# EAGLE design 20240717-7439 (EAGLE 6.6.0)

## Sheet 1 of 3
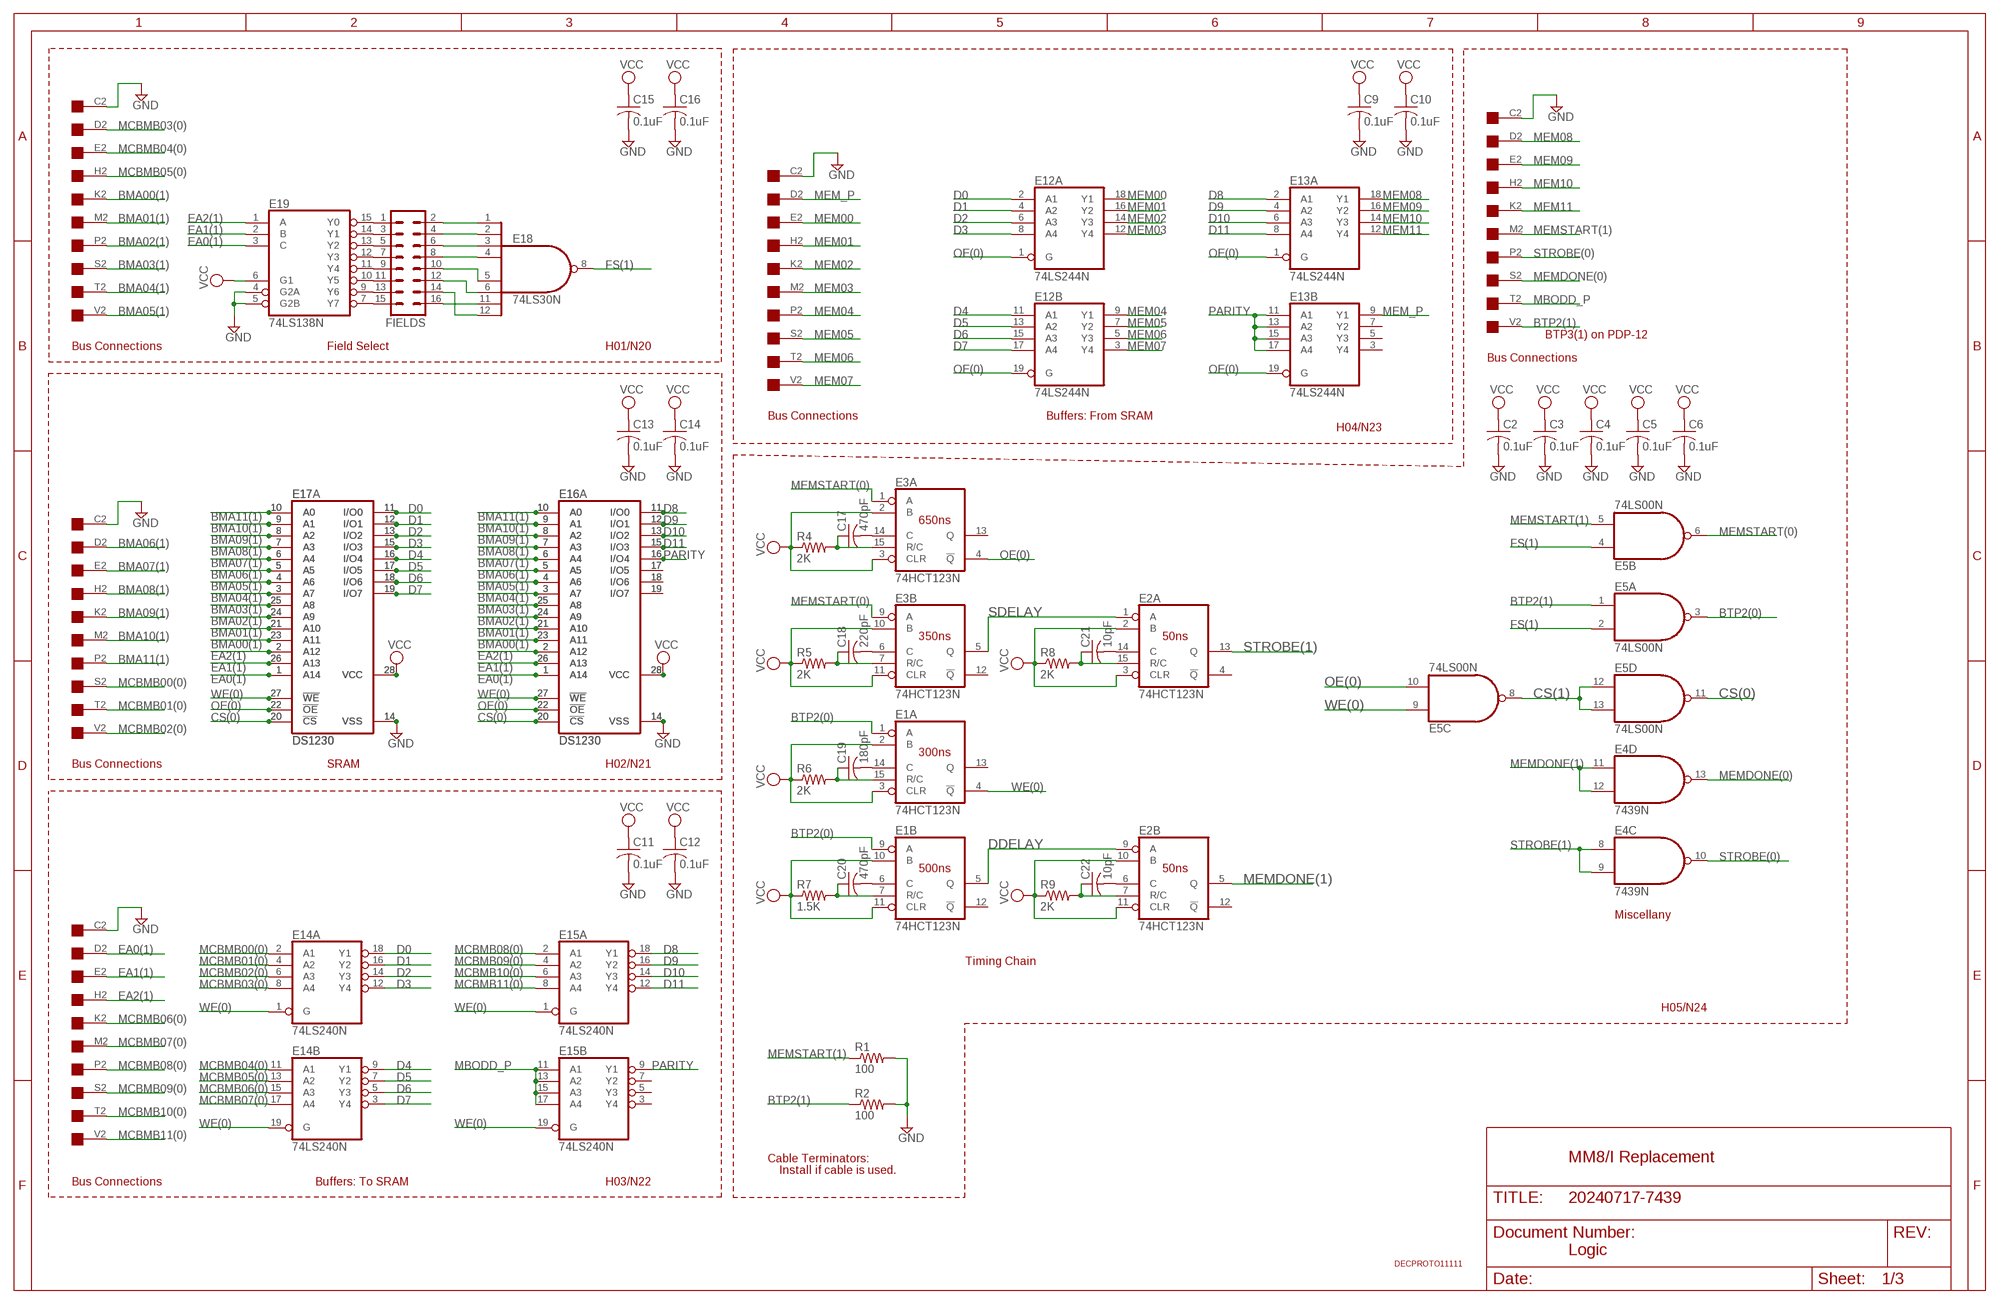
[diagram p0: schematic, sheet 1]

### Parts
C2  0.1uF  C-US050-025X075  [C050-025X075]
C3  0.1uF  C-US050-025X075  [C050-025X075]
C4  0.1uF  C-US050-025X075  [C050-025X075]
C5  0.1uF  C-US050-025X075  [C050-025X075]
C6  0.1uF  C-US050-025X075  [C050-025X075]
C9  0.1uF  C-US050-025X075  [C050-025X075]
C10  0.1uF  C-US050-025X075  [C050-025X075]
C11  0.1uF  C-US050-025X075  [C050-025X075]
C12  0.1uF  C-US050-025X075  [C050-025X075]
C13  0.1uF  C-US050-025X075  [C050-025X075]
C14  0.1uF  C-US050-025X075  [C050-025X075]
C15  0.1uF  C-US050-025X075  [C050-025X075]
C16  0.1uF  C-US050-025X075  [C050-025X075]
C17  470pF  C-US050-025X075  [C050-025X075]
C18  220pF  C-US050-025X075  [C050-025X075]
C19  180pF  C-US050-025X075  [C050-025X075]
C20  470pF  C-US050-025X075  [C050-025X075]
C21  10pF  C-US050-025X075  [C050-025X075]
C22  10pF  C-US050-025X075  [C050-025X075]
E1  74HCT123N  74LS123N  [DIL16]
E2  74HCT123N  74LS123N  [DIL16]
E3  74HCT123N  74LS123N  [DIL16]
E4  7439N  74LS01N  [DIL14]
E5  74LS00N  [DIL14]
E12  74LS244N  74S244N  [DIL20]
E13  74LS244N  74S244N  [DIL20]
E14  74LS240N  74S240N  [DIL20]
E15  74LS240N  74S240N  [DIL20]
E16  DS1230  62256P  [DIL28-6]
E16A  DS1230  62832P  [DIL28-3]
E17  DS1230  62256P  [DIL28-6]
E17A  DS1230  62832P  [DIL28-3]
E18  74LS30N  [DIL14]
E19  74LS138N  [DIL16]
FIELDS  MA08-2  [MA08-2]
H01  EDGE-1  [EDGE-CON1]
H02  EDGE-1  [EDGE-CON1]
H03  EDGE-1  [EDGE-CON1]
H04  EDGE-1  [EDGE-CON1]
H05  EDGE-1  [EDGE-CON1]
R1  100  R-US_0207/10  [0207/10]
R2  100  R-US_0207/10  [0207/10]
R4  2K  R-US_0207/10  [0207/10]
R5  2K  R-US_0207/10  [0207/10]
R6  2K  R-US_0207/10  [0207/10]
R7  1.5K  R-US_0207/10  [0207/10]
R8  2K  R-US_0207/10  [0207/10]
R9  2K  R-US_0207/10  [0207/10]
U$6  DECPROTO11111  [DECPROTO11111]

### Nets
BMA00(1): E16.23(A11) E16A.23(A11) E17.23(A11) E17A.23(A11) H01.K2 ; also sheet 2
BMA01(1): E16.21(A10) E16A.21(A10) E17.21(A10) E17A.21(A10) H01.M2 ; also sheet 2
BMA02(1): E16.24(A9) E16A.24(A9) E17.24(A9) E17A.24(A9) H01.P2 ; also sheet 2
BMA03(1): E16.25(A8) E16A.25(A8) E17.25(A8) E17A.25(A8) H01.S2 ; also sheet 2
BMA04(1): E16.3(A7) E16A.3(A7) E17.3(A7) E17A.3(A7) H01.T2 ; also sheet 2
BMA05(1): E16.4(A6) E16A.4(A6) E17.4(A6) E17A.4(A6) H01.V2 ; also sheet 2
BMA06(1): E16.5(A5) E16A.5(A5) E17.5(A5) E17A.5(A5) H02.D2 ; also sheet 2
BMA07(1): E16.6(A4) E16A.6(A4) E17.6(A4) E17A.6(A4) H02.E2 ; also sheet 2
BMA08(1): E16.7(A3) E16A.7(A3) E17.7(A3) E17A.7(A3) H02.H2 ; also sheet 2
BMA09(1): E16.8(A2) E16A.8(A2) E17.8(A2) E17A.8(A2) H02.K2 ; also sheet 2
BMA10(1): E16.9(A1) E16A.9(A1) E17.9(A1) E17A.9(A1) H02.M2 ; also sheet 2
BMA11(1): E16.10(A0) E16A.10(A0) E17.10(A0) E17A.10(A0) H02.P2 ; also sheet 2
BTP2(0): E1.1(A:A) E1.9(B:A) E5.3(A:O)
BTP2(1): E5.1(A:I0) H05.V2 R2.1
CS(0): E5.11(D:O) E16.20(!CS) E16A.20(!CS) E17.20(!CS) E17A.20(!CS) ; also sheet 2
CS(1): E5.8(C:O) E5.12(D:I0) E5.13(D:I1)
D0: E12.2(A:A1) E14.18(A:Y1) E17.11(I/O0) E17A.11(I/O0) ; also sheet 2
D1: E12.4(A:A2) E14.16(A:Y2) E17.12(I/O1) E17A.12(I/O1) ; also sheet 2
D2: E12.6(A:A3) E14.14(A:Y3) E17.13(I/O2) E17A.13(I/O2) ; also sheet 2
D3: E12.8(A:A4) E14.12(A:Y4) E17.15(I/O3) E17A.15(I/O3) ; also sheet 2
D4: E12.11(B:A1) E14.9(B:Y1) E17.16(I/O4) E17A.16(I/O4) ; also sheet 2
D5: E12.13(B:A2) E14.7(B:Y2) E17.17(I/O5) E17A.17(I/O5) ; also sheet 2
D6: E12.15(B:A3) E14.5(B:Y3) E17.18(I/O6) E17A.18(I/O6) ; also sheet 2
D7: E12.17(B:A4) E14.3(B:Y4) E17.19(I/O7) E17A.19(I/O7) ; also sheet 2
D8: E13.2(A:A1) E15.18(A:Y1) E16.11(I/O0) E16A.11(I/O0) ; also sheet 2
D9: E13.4(A:A2) E15.16(A:Y2) E16.12(I/O1) E16A.12(I/O1) ; also sheet 2
D10: E13.6(A:A3) E15.14(A:Y3) E16.13(I/O2) E16A.13(I/O2) ; also sheet 2
D11: E13.8(A:A4) E15.12(A:Y4) E16.15(I/O3) E16A.15(I/O3) ; also sheet 2
DDELAY: E1.5(B:Q) E2.9(B:A)
EA0(1): E16.1(A14) E16A.1(A14) E17.1(A14) E17A.1(A14) E19.3(C) H03.D2 ; also sheet 2
EA1(1): E16.26(A13) E16A.26(A13) E17.26(A13) E17A.26(A13) E19.2(B) H03.E2 ; also sheet 2
EA2(1): E16.2(A12) E16A.2(A12) E17.2(A12) E17A.2(A12) E19.1(A) H03.H2 ; also sheet 2
FS(1): E5.2(A:I1) E5.4(B:I0) E18.8(O) ; also sheet 2
GND [supply]: C2.2 C3.2 C4.2 C5.2 C6.2 C9.2 C10.2 C11.2 C12.2 C13.2 C14.2 C15.2 C16.2 E16.14(VSS) E16A.14(VSS) E17.14(VSS) E17A.14(VSS) E19.4(G2A) E19.5(G2B) H01.C2 H02.C2 H03.C2 H04.C2 H05.C2 R1.2 R2.2 ; also sheet 2
MBODD_P: E15.11(B:A1) E15.13(B:A2) E15.15(B:A3) E15.17(B:A4) H05.T2 ; also sheet 2
MCBMB00(0): E14.2(A:A1) H02.S2 ; also sheet 2
MCBMB01(0): E14.4(A:A2) H02.T2 ; also sheet 2
MCBMB02(0): E14.6(A:A3) H02.V2 ; also sheet 2
MCBMB03(0): E14.8(A:A4) H01.D2 ; also sheet 2
MCBMB04(0): E14.11(B:A1) H01.E2 ; also sheet 2
MCBMB05(0): E14.13(B:A2) H01.H2 ; also sheet 2
MCBMB06(0): E14.15(B:A3) H03.K2
MCBMB07(0): E14.17(B:A4) H03.M2
MCBMB08(0): E15.2(A:A1) H03.P2
MCBMB09(0): E15.4(A:A2) H03.S2
MCBMB10(0): E15.6(A:A3) H03.T2
MCBMB11(0): E15.8(A:A4) H03.V2
MEM00: E12.18(A:Y1) H04.E2
MEM01: E12.16(A:Y2) H04.H2
MEM02: E12.14(A:Y3) H04.K2
MEM03: E12.12(A:Y4) H04.M2
MEM04: E12.9(B:Y1) H04.P2
MEM05: E12.7(B:Y2) H04.S2
MEM06: E12.5(B:Y3) H04.T2
MEM07: E12.3(B:Y4) H04.V2
MEM08: E13.18(A:Y1) H05.D2 ; also sheet 2
MEM09: E13.16(A:Y2) H05.E2 ; also sheet 2
MEM10: E13.14(A:Y3) H05.H2 ; also sheet 2
MEM11: E13.12(A:Y4) H05.K2 ; also sheet 2
MEM_P: E13.9(B:Y1) H04.D2
MEMDONE(0): E4.13(D:O) H05.S2
MEMDONE(1): E2.5(B:Q) E4.11(D:I0) E4.12(D:I1)
MEMSTART(0): E3.1(A:A) E3.9(B:A) E5.6(B:O)
MEMSTART(1): E5.5(B:I1) H05.M2 R1.1
N$2: E16.17(I/O5) E16A.17(I/O5)
N$3: E16.18(I/O6) E16A.18(I/O6)
N$4: E16.19(I/O7) E16A.19(I/O7)
N$5: C17.1 E3.15(A:R/C) R4.2
N$6: C17.2 E3.14(A:C)
N$7: C18.1 E3.7(B:R/C) R5.2
N$8: C18.2 E3.6(B:C)
N$9: C19.1 E1.15(A:R/C) R6.2
N$10: C19.2 E1.14(A:C)
N$11: C20.1 E1.7(B:R/C) R7.2
N$12: C20.2 E1.6(B:C)
N$13: C21.1 E2.15(A:R/C) R8.2
N$14: C21.2 E2.14(A:C)
N$15: C22.1 E2.7(B:R/C) R9.2
N$16: C22.2 E2.6(B:C)
N$18: E19.15(Y0) FIELDS.1
N$19: E19.14(Y1) FIELDS.3
N$20: E19.13(Y2) FIELDS.5
N$21: E19.12(Y3) FIELDS.7
N$22: E19.11(Y4) FIELDS.9
N$23: E19.10(Y5) FIELDS.11
N$24: E19.9(Y6) FIELDS.13
N$25: E19.7(Y7) FIELDS.15
N$26: E18.4(I3) FIELDS.8
N$27: E18.3(I2) FIELDS.6
N$28: E18.2(I1) FIELDS.4
N$29: E18.1(I0) FIELDS.2
N$30: E18.5(I4) FIELDS.10
N$31: E18.6(I5) FIELDS.12
N$32: E18.12(I7) FIELDS.14
N$33: E18.11(I6) FIELDS.16
OE(0): E3.4(A:!Q) E5.10(C:I1) E12.1(A:G) E12.19(B:G) E13.1(A:G) E13.19(B:G) E16.22(!OE) E16A.22(!OE) E17.22(!OE) E17A.22(!OE) ; also sheet 2
PARITY: E13.11(B:A1) E13.13(B:A2) E13.15(B:A3) E13.17(B:A4) E15.9(B:Y1) E16.16(I/O4) E16A.16(I/O4) ; also sheet 2
SDELAY: E2.1(A:A) E3.5(B:Q)
STROBE(0): E4.10(C:O) H05.P2
STROBE(1): E2.13(A:Q) E4.8(C:I0) E4.9(C:I1)
VCC [supply]: C2.1 C3.1 C4.1 C5.1 C6.1 C9.1 C10.1 C11.1 C12.1 C13.1 C14.1 C15.1 C16.1 E1.2(A:B) E1.3(A:CLR) E1.10(B:B) E1.11(B:CLR) E2.2(A:B) E2.3(A:CLR) E2.10(B:B) E2.11(B:CLR) E3.2(A:B) E3.3(A:CLR) E3.10(B:B) E3.11(B:CLR) E16.28(VCC) E16A.28(VCC) E17.28(VCC) E17A.28(VCC) E19.6(G1) R4.1 R5.1 R6.1 R7.1 R8.1 R9.1 ; also sheet 2
WE(0): E1.4(A:!Q) E5.9(C:I0) E14.1(A:G) E14.19(B:G) E15.1(A:G) E15.19(B:G) E16.27(!WE) E16A.27(!WE) E17.27(!WE) E17A.27(!WE) ; also sheet 2
Unconnected: E1.12(B:!Q) E1.13(A:Q) E2.4(A:!Q) E2.12(B:!Q) E3.12(B:!Q) E3.13(A:Q) E13.3(B:Y4) E13.5(B:Y3) E13.7(B:Y2) E15.3(B:Y4) E15.5(B:Y3) E15.7(B:Y2) H01.A2 H01.B2 H01.F2 H01.J2 H01.L2 H01.N2 H01.R2 H01.U2 H02.A2 H02.B2 H02.F2 H02.J2 H02.L2 H02.N2 H02.R2 H02.U2 H03.A2 H03.B2 H03.F2 H03.J2 H03.L2 H03.N2 H03.R2 H03.U2 H04.A2 H04.B2 H04.F2 H04.J2 H04.L2 H04.N2 H04.R2 H04.U2 H05.A2 H05.B2 H05.F2 H05.J2 H05.L2 H05.N2 H05.R2 H05.U2

### Notes on the sheet
- BTP3(1) on PDP-12
- Bus Connections | Field Select | H01/N20
- Bus Connections
- Bus Connections | Buffers: From SRAM
- H04/N23
- 650ns
- 350ns | 50ns
- 300ns
- Bus Connections | SRAM | H02/N21
- 500ns | 50ns
- Miscellany
- Timing Chain
- H05/N24
- Cable Terminators: | MM8/I Replacement
- Install if cable is used.
- Bus Connections | Buffers: To SRAM | H03/N22
- Logic

## Sheet 2 of 3
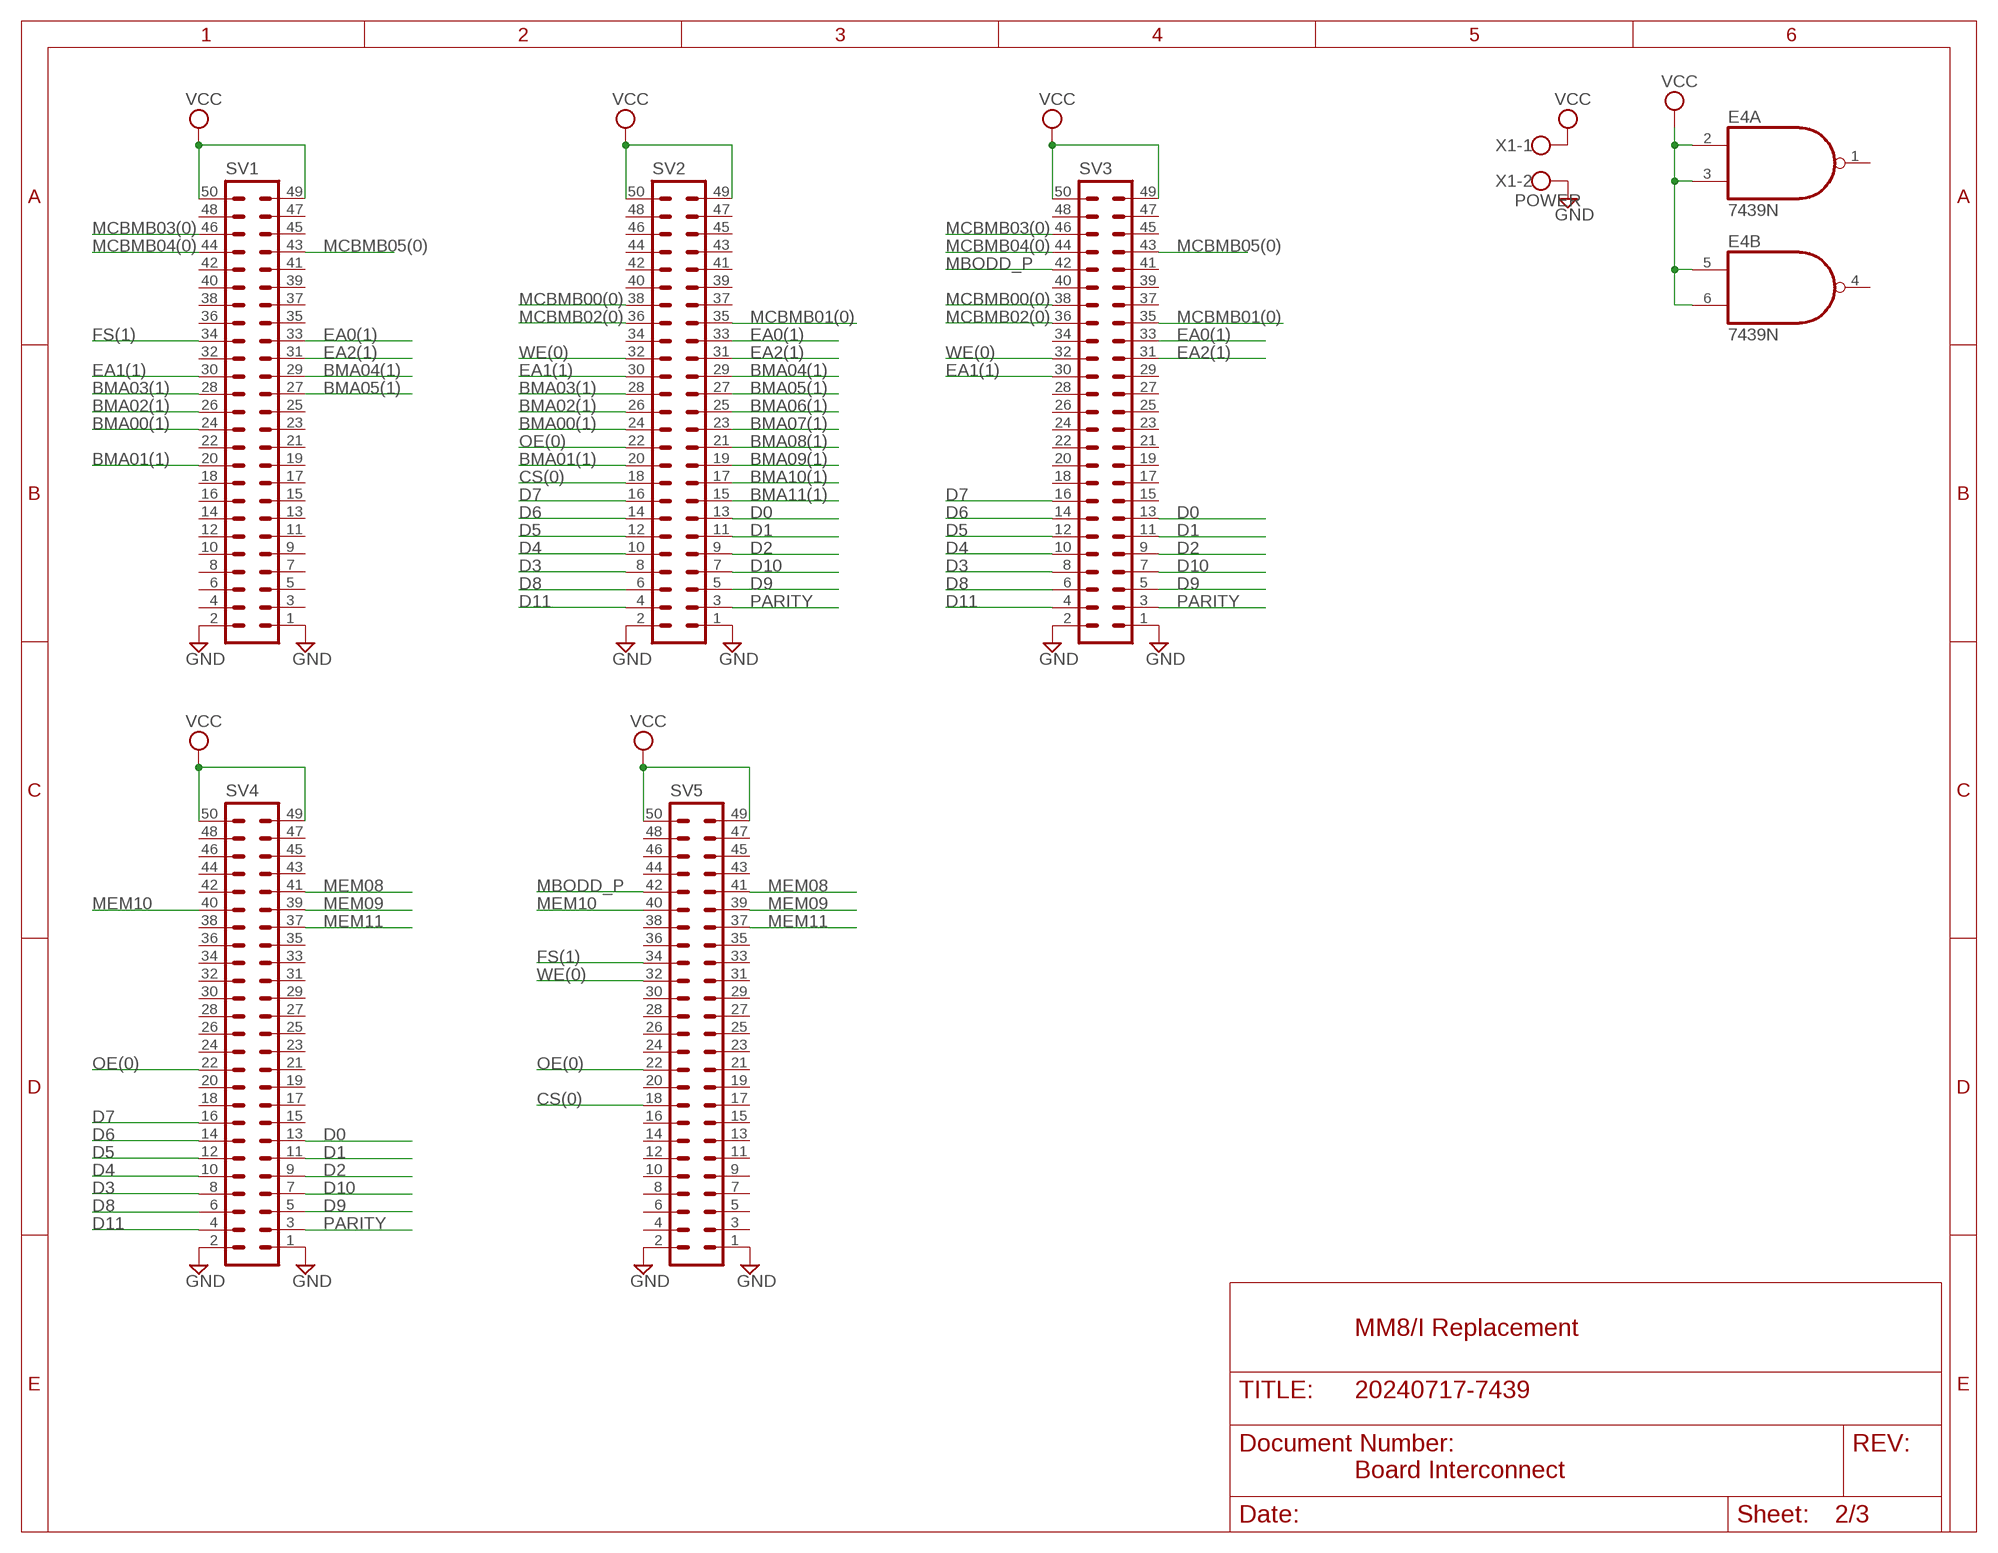
[diagram p1: schematic, sheet 2]

### Parts
SV1  ML50L  [ML50L]
SV2  ML50L  [ML50L]
SV3  ML50L  [ML50L]
SV4  ML50L  [ML50L]
SV5  ML50L  [ML50L]
X1  POWER  W237-102  [W237-102]

### Nets
BMA00(1): SV1.24 SV2.24 ; also sheet 1
BMA01(1): SV1.20 SV2.20 ; also sheet 1
BMA02(1): SV1.26 SV2.26 ; also sheet 1
BMA03(1): SV1.28 SV2.28 ; also sheet 1
BMA04(1): SV1.29 SV2.29 ; also sheet 1
BMA05(1): SV1.27 SV2.27 ; also sheet 1
BMA06(1): SV2.25 ; also sheet 1
BMA07(1): SV2.23 ; also sheet 1
BMA08(1): SV2.21 ; also sheet 1
BMA09(1): SV2.19 ; also sheet 1
BMA10(1): SV2.17 ; also sheet 1
BMA11(1): SV2.15 ; also sheet 1
CS(0): SV2.18 SV5.18 ; also sheet 1
D0: SV2.13 SV3.13 SV4.13 ; also sheet 1
D1: SV2.11 SV3.11 SV4.11 ; also sheet 1
D2: SV2.9 SV3.9 SV4.9 ; also sheet 1
D3: SV2.8 SV3.8 SV4.8 ; also sheet 1
D4: SV2.10 SV3.10 SV4.10 ; also sheet 1
D5: SV2.12 SV3.12 SV4.12 ; also sheet 1
D6: SV2.14 SV3.14 SV4.14 ; also sheet 1
D7: SV2.16 SV3.16 SV4.16 ; also sheet 1
D8: SV2.6 SV3.6 SV4.6 ; also sheet 1
D9: SV2.5 SV3.5 SV4.5 ; also sheet 1
D10: SV2.7 SV3.7 SV4.7 ; also sheet 1
D11: SV2.4 SV3.4 SV4.4 ; also sheet 1
EA0(1): SV1.33 SV2.33 SV3.33 ; also sheet 1
EA1(1): SV1.30 SV2.30 SV3.30 ; also sheet 1
EA2(1): SV1.31 SV2.31 SV3.31 ; also sheet 1
FS(1): SV1.34 SV5.34 ; also sheet 1
GND [supply]: SV1.1 SV1.2 SV2.1 SV2.2 SV3.1 SV3.2 SV4.1 SV4.2 SV5.1 SV5.2 X1.2 ; also sheet 1
MBODD_P: SV3.42 SV5.42 ; also sheet 1
MCBMB00(0): SV2.38 SV3.38 ; also sheet 1
MCBMB01(0): SV2.35 SV3.35 ; also sheet 1
MCBMB02(0): SV2.36 SV3.36 ; also sheet 1
MCBMB03(0): SV1.46 SV3.46 ; also sheet 1
MCBMB04(0): SV1.44 SV3.44 ; also sheet 1
MCBMB05(0): SV1.43 SV3.43 ; also sheet 1
MEM08: SV4.41 SV5.41 ; also sheet 1
MEM09: SV4.39 SV5.39 ; also sheet 1
MEM10: SV4.40 SV5.40 ; also sheet 1
MEM11: SV4.37 SV5.37 ; also sheet 1
OE(0): SV2.22 SV4.22 SV5.22 ; also sheet 1
PARITY: SV2.3 SV3.3 SV4.3 ; also sheet 1
VCC [supply]: E4.2(A:I0) E4.3(A:I1) E4.5(B:I0) E4.6(B:I1) SV1.49 SV1.50 SV2.49 SV2.50 SV3.49 SV3.50 SV4.49 SV4.50 SV5.49 SV5.50 X1.1 ; also sheet 1
WE(0): SV2.32 SV3.32 SV5.32 ; also sheet 1
Unconnected: E4.1(A:O) E4.4(B:O) SV1.3 SV1.4 SV1.5 SV1.6 SV1.7 SV1.8 SV1.9 SV1.10 SV1.11 SV1.12 SV1.13 SV1.14 SV1.15 SV1.16 SV1.17 SV1.18 SV1.19 SV1.21 SV1.22 SV1.23 SV1.25 SV1.32 SV1.35 SV1.36 SV1.37 SV1.38 SV1.39 SV1.40 SV1.41 SV1.42 SV1.45 SV1.47 SV1.48 SV2.34 SV2.37 SV2.39 SV2.40 SV2.41 SV2.42 SV2.43 SV2.44 SV2.45 SV2.46 SV2.47 SV2.48 SV3.15 SV3.17 SV3.18 SV3.19 SV3.20 SV3.21 SV3.22 SV3.23 SV3.24 SV3.25 SV3.26 SV3.27 SV3.28 SV3.29 SV3.34 SV3.37 SV3.39 SV3.40 SV3.41 SV3.45 SV3.47 SV3.48 SV4.15 SV4.17 SV4.18 SV4.19 SV4.20 SV4.21 SV4.23 SV4.24 SV4.25 SV4.26 SV4.27 SV4.28 SV4.29 SV4.30 SV4.31 SV4.32 SV4.33 SV4.34 SV4.35 SV4.36 SV4.38 SV4.42 SV4.43 SV4.44 SV4.45 SV4.46 SV4.47 SV4.48 SV5.3 SV5.4 SV5.5 SV5.6 SV5.7 SV5.8 SV5.9 SV5.10 SV5.11 SV5.12 SV5.13 SV5.14 SV5.15 SV5.16 SV5.17 SV5.19 SV5.20 SV5.21 SV5.23 SV5.24 SV5.25 SV5.26 SV5.27 SV5.28 SV5.29 SV5.30 SV5.31 SV5.33 SV5.35 SV5.36 SV5.38 SV5.43 SV5.44 SV5.45 SV5.46 SV5.47 SV5.48

### Notes on the sheet
- MM8/I Replacement
- Board Interconnect

## Sheet 3 of 3
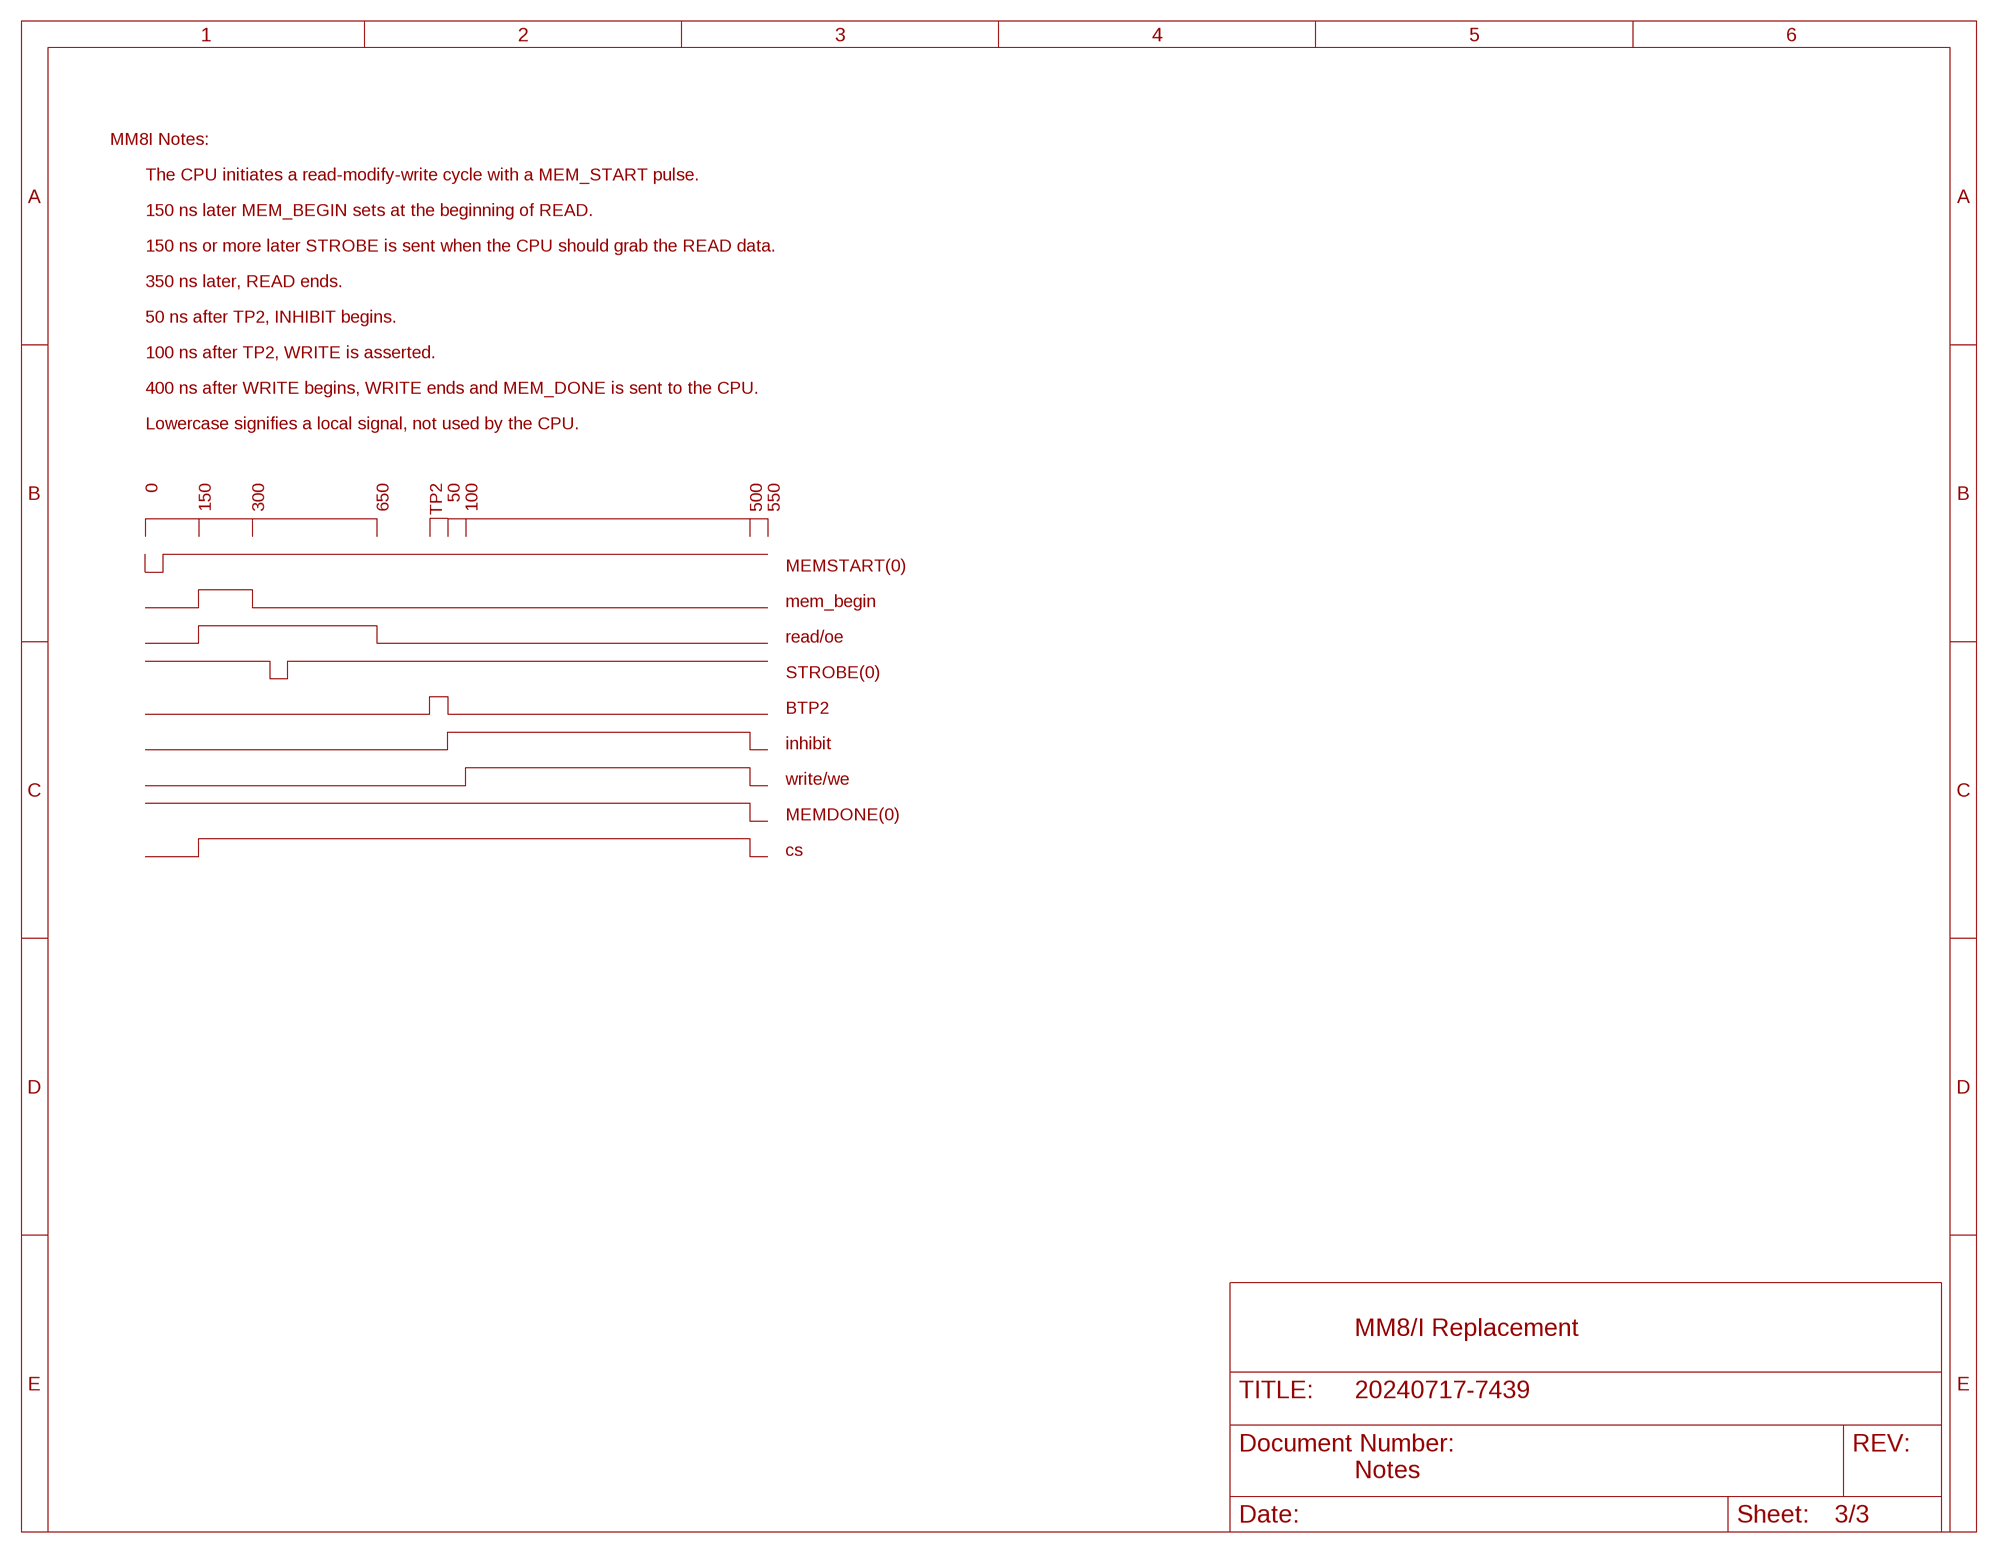
[diagram p2: schematic, sheet 3]

### Notes on the sheet
- MM8I Notes:
- The CPU initiates a read-modify-write cycle with a MEM_START pulse.
- 150 ns later MEM_BEGIN sets at the beginning of READ.
- 150 ns or more later STROBE is sent when the CPU should grab the READ data.
- 350 ns later, READ ends.
- 50 ns after TP2, INHIBIT begins.
- 100 ns after TP2, WRITE is asserted.
- 400 ns after WRITE begins, WRITE ends and MEM_DONE is sent to the CPU.
- Lowercase signifies a local signal, not used by the CPU.
- 0 | 150 | 300 | 650 | TP2 | 50 | 100 | 500 | 550
- MEMSTART(0)
- mem_begin
- read/oe
- STROBE(0)
- BTP2
- inhibit
- write/we
- MEMDONE(0)
- cs
- MM8/I Replacement
- Notes

## Power pins joined to a net without a drawn wire
GND: E1.8(P:GND) E2.8(P:GND) E3.8(P:GND) E4.7(P:GND) E5.7(P:GND) E12.10(P:GND) E13.10(P:GND) E14.10(P:GND) E15.10(P:GND) E18.7(GND) E19.8(GND)
VCC: E1.16(P:VCC) E2.16(P:VCC) E3.16(P:VCC) E4.14(P:VCC) E5.14(P:VCC) E12.20(P:VCC) E13.20(P:VCC) E14.20(P:VCC) E15.20(P:VCC) E18.14(VCC) E19.16(VCC)

## Library data of the parts
C2-C6 C9-C22 = rcl:C-US: CAPACITOR, American symbol
E1-E3 = 74xx-us:74*123: Retriggerable monostable MULTIVIBRATOR
E4 = 74xx-us:74*01: Quad 2-input NAND gate, open collector
E5 = 74xx-us:74*00: Quad 2-input NAND gate
E12 E13 = 74xx-us:74*244: Octal BUFFER and LINE DRIVER, 3-state
E14 E15 = 74xx-us:74*240: Octal BUFFER and LINE DRIVER, 3-state
E16 E17 = memory-hitachi:62256P: MEMORY; OC_FARNELL: unknown; OC_NEWARK: unknown
E16A E17A = memory-hitachi:62832P: MEMORY; OC_FARNELL: unknown; OC_NEWARK: unknown
E18 = 74xx-us:74*30: 8-input NAND gate
E19 = 74xx-us:74*138: 3-line to 8-line DECODER/DEMULTIPLEXER
FIELDS = con-lstb:MA08-2: PIN HEADER; OC_FARNELL: unknown; OC_NEWARK: unknown
H01-H05 = dec-con:EDGE-1: Single-Sided DEC Edge Connector -- (side 2)
R1 R2 R4-R9 = rcl:R-US_: RESISTOR, American symbol
SV1-SV5 = con-ml:ML50L: HARTING; OC_FARNELL: unknown; OC_NEWARK: unknown
U$6 = dec-con:DECPROTO: Various small DEC boards stuck together with break-away tab routing.
X1 = con-wago-500:W237-102: WAGO SCREW CLAMP; MPN: 237-102; OC_FARNELL: unknown; OC_NEWARK: 70K9898

## Net classes
1 supply: width 0.711 mm

## Board
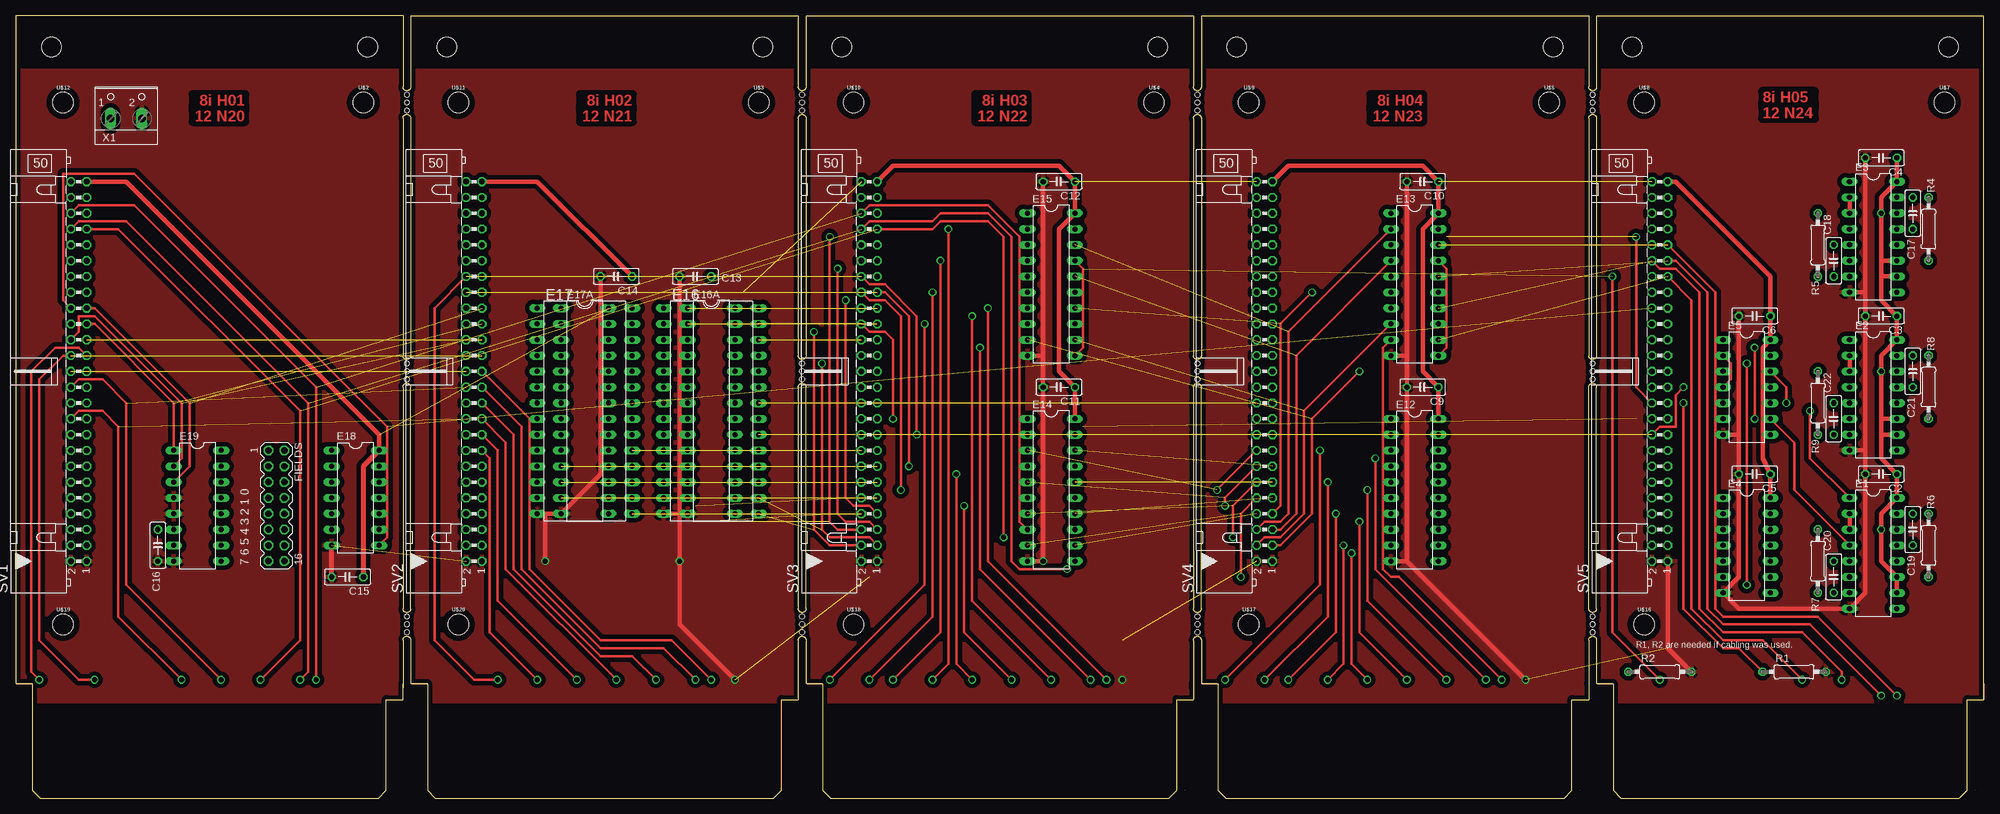
[diagram p3: board, top side]
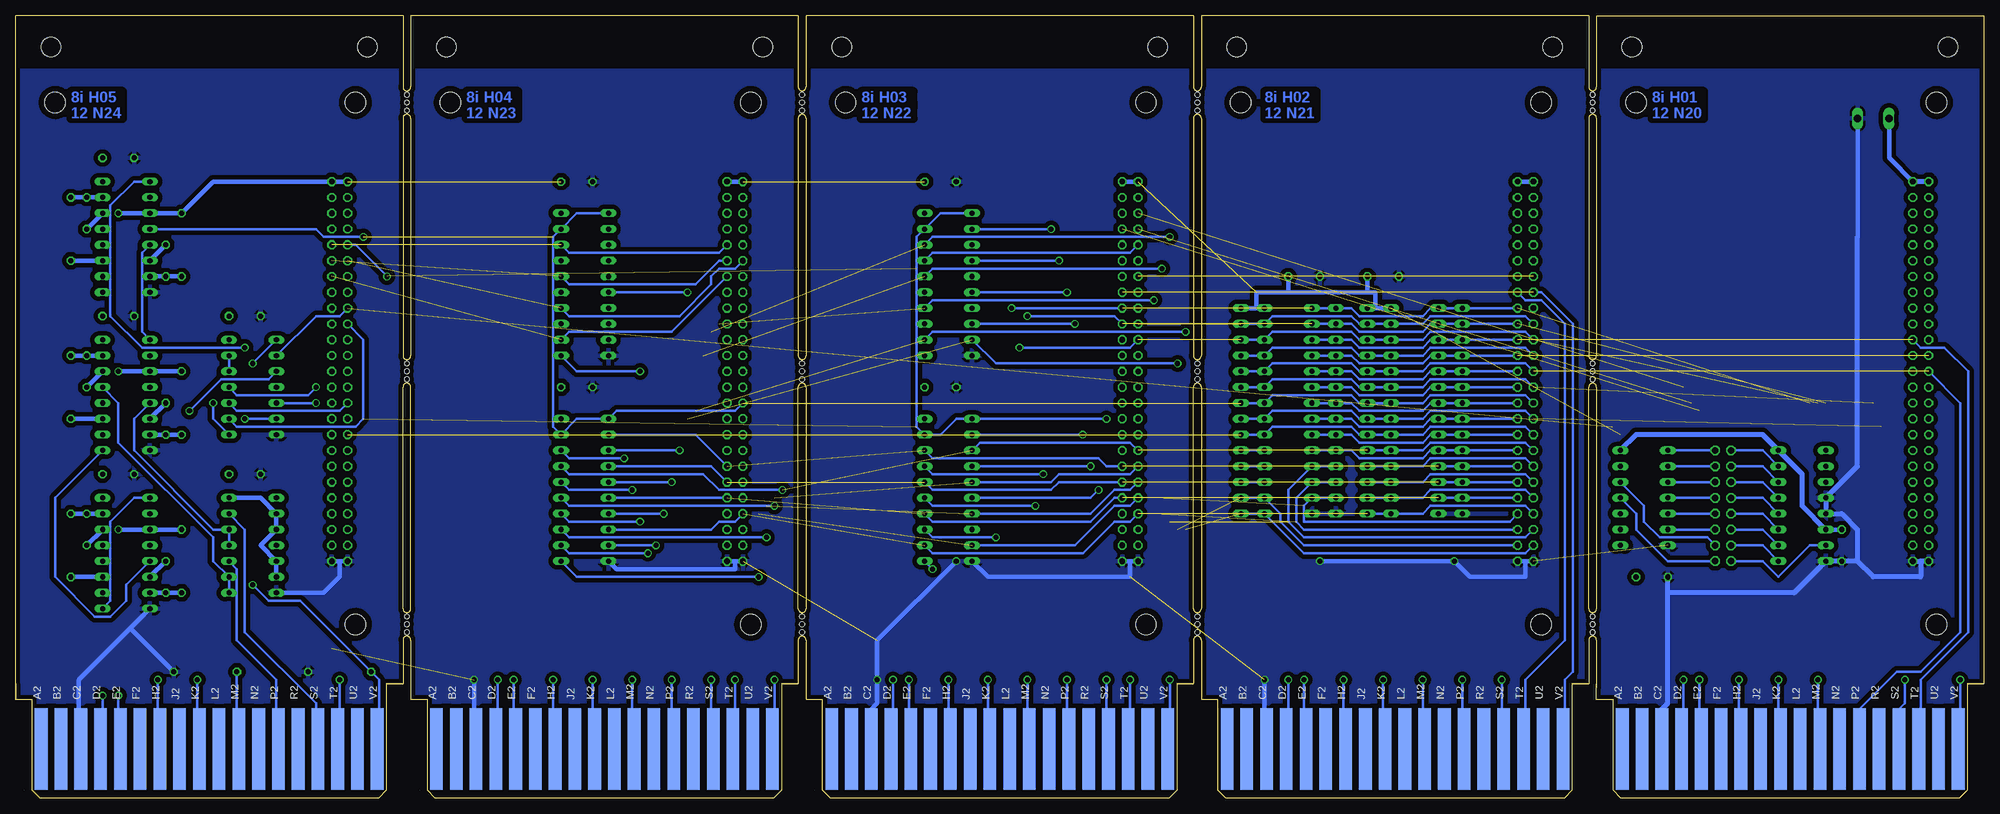
[diagram p4: board, bottom side, seen from below]

Size 316.23 x 125.73 mm. Coordinates in mm from the lower left corner, seen from the top.
Copper layers (1+16): Top 0.035mm / dielectric 1.5mm / Bottom 0.035mm
Design rules "16mils *": minimum track width 16mil, minimum drill 32mil, track to track 15mil, track to pad 10mil, pad to pad 10mil, via to via 10mil, smd to smd 10mil, copper to edge 13mil, drill to drill 10mil, minimum pad ring 10mil, minimum via ring 8mil, stop-mask expansion 0mil, vias tented up to drill 0mil, thermal gap 16mil

### Footprints (pad centres in the part's own frame; a part is rotated, then mirrored left to right if it is on the bottom)
C050-025X075 = drill 0.813 octagon: 1 -2.54,0; 2 2.54,0
DIL16 = drill 0.813 long: 1 -8.89,-3.81; 2 -6.35,-3.81; 3 -3.81,-3.81; 4 -1.27,-3.81; 5 1.27,-3.81; 6 3.81,-3.81; 7 6.35,-3.81; 8 8.89,-3.81; 9 8.89,3.81; 10 6.35,3.81; 11 3.81,3.81; 12 1.27,3.81; 13 -1.27,3.81; 14 -3.81,3.81; 15 -6.35,3.81; 16 -8.89,3.81
DIL14 = drill 0.813 long: 1 -7.62,-3.81; 2 -5.08,-3.81; 3 -2.54,-3.81; 4 0,-3.81; 5 2.54,-3.81; 6 5.08,-3.81; 7 7.62,-3.81; 8 7.62,3.81; 9 5.08,3.81; 10 2.54,3.81; 11 0,3.81; 12 -2.54,3.81; 13 -5.08,3.81; 14 -7.62,3.81
DIL20 = drill 0.813 long: 1 -11.43,-3.81; 2 -8.89,-3.81; 3 -6.35,-3.81; 4 -3.81,-3.81; 5 -1.27,-3.81; 6 1.27,-3.81; 7 3.81,-3.81; 8 6.35,-3.81; 9 8.89,-3.81; 10 11.43,-3.81; 11 11.43,3.81; 12 8.89,3.81; 13 6.35,3.81; 14 3.81,3.81; 15 1.27,3.81; 16 -1.27,3.81; 17 -3.81,3.81; 18 -6.35,3.81; 19 -8.89,3.81; 20 -11.43,3.81
DIL28-6 = drill 0.813 long: 1 -16.51,-7.62; 2 -13.97,-7.62; 3 -11.43,-7.62; 4 -8.89,-7.62; 5 -6.35,-7.62; 6 -3.81,-7.62; 7 -1.27,-7.62; 8 1.27,-7.62; 9 3.81,-7.62; 10 6.35,-7.62; 11 8.89,-7.62; 12 11.43,-7.62; 13 13.97,-7.62; 14 16.51,-7.62; 15 16.51,7.62; 16 13.97,7.62; 17 11.43,7.62; 18 8.89,7.62; 19 6.35,7.62; 20 3.81,7.62; 21 1.27,7.62; 22 -1.27,7.62; 23 -3.81,7.62; 24 -6.35,7.62; 25 -8.89,7.62; 26 -11.43,7.62; 27 -13.97,7.62; 28 -16.51,7.62
DIL28-3 = drill 0.813 long: 1 -16.51,-3.81; 2 -13.97,-3.81; 3 -11.43,-3.81; 4 -8.89,-3.81; 5 -6.35,-3.81; 6 -3.81,-3.81; 7 -1.27,-3.81; 8 1.27,-3.81; 9 3.81,-3.81; 10 6.35,-3.81; 11 8.89,-3.81; 12 11.43,-3.81; 13 13.97,-3.81; 14 16.51,-3.81; 15 16.51,3.81; 16 13.97,3.81; 17 11.43,3.81; 18 8.89,3.81; 19 6.35,3.81; 20 3.81,3.81; 21 1.27,3.81; 22 -1.27,3.81; 23 -3.81,3.81; 24 -6.35,3.81; 25 -8.89,3.81; 26 -11.43,3.81; 27 -13.97,3.81; 28 -16.51,3.81
MA08-2 = drill 1.016 octagon: 1 -8.89,-1.27; 2 -8.89,1.27; 3 -6.35,-1.27; 4 -6.35,1.27; 5 -3.81,-1.27; 6 -3.81,1.27; 7 -1.27,-1.27; 8 -1.27,1.27; 9 1.27,-1.27; 10 1.27,1.27; 11 3.81,-1.27; 12 3.81,1.27; 13 6.35,-1.27; 14 6.35,1.27; 15 8.89,-1.27; 16 8.89,1.27
EDGE-CON1 = smd 13.106 x 2.032 bottom: A2 7.938,4.128; B2 7.938,7.303; C2 7.938,10.477; D2 7.938,13.652; E2 7.938,16.828; F2 7.938,20.003; H2 7.938,23.177; J2 7.938,26.352; K2 7.938,29.527; L2 7.938,32.703; M2 7.938,35.877; N2 7.938,39.053; P2 7.938,42.227; R2 7.938,45.403; S2 7.938,48.578; T2 7.938,51.752; U2 7.938,54.928; V2 7.938,58.102
0207/10 = drill 0.813 octagon: 1 -5.08,0; 2 5.08,0
ML50L = drill 0.914 octagon: 1 -30.48,-1.27; 2 -30.48,1.27; 3 -27.94,-1.27; 4 -27.94,1.27; 5 -25.4,-1.27; 6 -25.4,1.27; 7 -22.86,-1.27; 8 -22.86,1.27; 9 -20.32,-1.27; 10 -20.32,1.27; 11 -17.78,-1.27; 12 -17.78,1.27; 13 -15.24,-1.27; 14 -15.24,1.27; 15 -12.7,-1.27; 16 -12.7,1.27; 17 -10.16,-1.27; 18 -10.16,1.27; 19 -7.62,-1.27; 20 -7.62,1.27; 21 -5.08,-1.27; 22 -5.08,1.27; 23 -2.54,-1.27; 24 -2.54,1.27; 25 0,-1.27; 26 0,1.27; 27 2.54,-1.27; 28 2.54,1.27; 29 5.08,-1.27; 30 5.08,1.27; 31 7.62,-1.27; 32 7.62,1.27; 33 10.16,-1.27; 34 10.16,1.27; 35 12.7,-1.27; 36 12.7,1.27; 37 15.24,-1.27; 38 15.24,1.27; 39 17.78,-1.27; 40 17.78,1.27; 41 20.32,-1.27; 42 20.32,1.27; 43 22.86,-1.27; 44 22.86,1.27; 45 25.4,-1.27; 46 25.4,1.27; 47 27.94,-1.27; 48 27.94,1.27; 49 30.48,-1.27; 50 30.48,1.27
STAND-OFF = hole 3.302: 0,0
DECPROTO11111 = hole 3.175: 183.515,120.65; 132.715,120.65; 69.266,120.65; 120.066,120.65; 56.566,120.65; 5.766,120.65; 247.015,120.65; 196.215,120.65; 310.515,120.65; 259.715,120.65 | hole 0.813: 62.865,69.85; 62.865,68.58; 62.865,67.31; 62.865,26.67; 62.865,27.94; 62.865,29.21; 62.865,113.03; 62.865,110.49; 62.865,111.76; 126.365,69.85; 126.365,68.58; 126.365,67.31; 126.365,26.67; 126.365,27.94; 126.365,29.21; 126.365,113.03; 126.365,110.49; 126.365,111.76; 189.865,26.67; 189.865,27.94; 189.865,29.21; 189.865,67.31; 189.865,68.58; 189.865,69.85; 189.865,110.49; 189.865,111.76; 189.865,113.03; 253.365,26.67; 253.365,27.94; 253.365,29.21; 253.365,67.31; 253.365,68.58; 253.365,69.85; 253.365,110.49; 253.365,111.76; 253.365,113.03
W237-102 = drill 1.194 long: 1 -2.5,-1.27; 2 2.5,-1.27

### Placement (x,y rotation side)
C2  299.72,52.07 180 top
C3  299.72,77.47 180 top
C4  299.72,102.87 180 top
C5  279.4,52.07 180 top
C6  279.4,77.47 180 top
C9  226.06,66.04 180 top
C10  226.06,99.06 180 top
C11  167.64,66.04 180 top
C12  167.64,99.06 180 top
C13  109.22,83.82 180 top
C14  96.52,83.82 180 top
C15  53.34,35.56 180 top
C16  22.86,40.64 270 top
C17  304.8,93.98 270 top
C18  292.1,86.36 90 top
C19  304.8,43.18 270 top
C20  292.1,35.56 90 top
C21  304.8,68.58 270 top
C22  292.1,60.96 90 top
E1  298.45,39.37 270 top
E2  298.45,64.77 270 top
E3  298.45,90.17 270 top
E4  278.13,40.64 270 top
E5  278.13,66.04 270 top
E12  224.79,49.53 270 top
E13  224.79,82.55 270 top
E14  166.37,49.53 270 top
E15  166.37,82.55 270 top
E16  111.76,62.23 270 top
E16A  111.76,62.23 270 top
E17  91.44,62.23 270 top
E17A  91.44,62.23 270 top
E18  54.61,48.26 270 top
E19  29.21,46.99 270 top
FIELDS  41.91,46.99 270 top
H01  62.23,0 90 top
H02  125.73,0 90 top
H03  189.23,0 90 top
H04  252.73,0 90 top
H05  316.23,0 90 top
R1  285.75,20.32 0 top
R2  264.16,20.32 0 top
R4  307.34,91.44 90 top
R5  289.56,88.9 270 top
R6  307.34,40.64 90 top
R7  289.56,38.1 270 top
R8  307.34,66.04 90 top
R9  289.56,63.5 270 top
SV1  10.16,68.58 90 top
SV2  73.66,68.58 90 top
SV3  137.16,68.58 90 top
SV4  200.66,68.58 90 top
SV5  264.16,68.58 90 top
U$2  [STAND-OFF]  55.88,111.76 0 top
U$3  [STAND-OFF]  119.38,111.76 0 top
U$4  [STAND-OFF]  182.88,111.76 0 top
U$5  [STAND-OFF]  246.38,111.76 0 top
U$6  0,0 0 top
U$7  [STAND-OFF]  309.88,111.76 0 top
U$8  [STAND-OFF]  261.62,111.76 0 top
U$9  [STAND-OFF]  198.12,111.76 0 top
U$10  [STAND-OFF]  134.62,111.76 0 top
U$11  [STAND-OFF]  71.12,111.76 0 top
U$12  [STAND-OFF]  7.62,111.76 0 top
U$16  [STAND-OFF]  261.62,27.94 0 top
U$17  [STAND-OFF]  198.12,27.94 0 top
U$18  [STAND-OFF]  134.62,27.94 0 top
U$19  [STAND-OFF]  7.62,27.94 0 top
U$20  [STAND-OFF]  71.12,27.94 0 top
X1  17.78,110.49 0 top

### Tracks (layer width: path | path; a pad name or v marks a point on that pad's centre or on a via)
BMA00(1)  (via drill 0.81)  (1 unrouted)
  Top 0.406: SV1.24 10.16,67.31 13.97,67.31 17.78,63.5 17.78,34.29 v33.02,19.05
  Bottom 0.406: H01.K2 32.7,8.57 33.02,8.89 v33.02,19.05 | E16.23 E16A.23 114.3,67.31 101.6,67.31 100.33,66.04 E17.23 E17A.23 90.17,66.04 88.9,67.31 73.66,67.31 SV2.24
BMA01(1)  (via drill 0.81)  (1 unrouted)
  Top 0.406: SV1.20 10.16,62.23 13.97,62.23 16.51,59.69 16.51,29.21 v26.67,19.05
  Bottom 0.406: H01.M2 26.35,8.57 26.67,8.89 v26.67,19.05 | E16.21 E16A.21 114.3,62.23 101.6,62.23 100.33,60.96 E17.21 E17A.21 90.17,60.96 88.9,62.23 73.66,62.23 SV2.20
BMA02(1)  (1 unrouted)
  Bottom 0.406: H01.P2 20,8.57 20.32,8.89 20.32,13.97 13.97,20.32 10.16,20.32 3.81,26.67 3.81,63.5 SV1.26 | E16.24 E16A.24 114.3,69.85 101.6,69.85 100.33,68.58 E17.24 E17A.24 90.17,68.58 88.9,69.85 73.66,69.85 SV2.26
BMA03(1)  (via drill 0.81)  (1 unrouted)
  Top 0.406: SV1.28 7.62,71.12 3.81,67.31 3.81,25.4 10.16,19.05 v12.7,19.05
  Bottom 0.406: H01.S2 13.65,8.57 13.97,8.89 13.97,13.97 12.7,15.24 v12.7,19.05 | E16.25 E16A.25 114.3,72.39 101.6,72.39 100.33,71.12 E17.25 E17A.25 90.17,71.12 88.9,72.39 73.66,72.39 SV2.28
BMA04(1)  (1 unrouted)
  Bottom 0.406: H01.T2 10.48,8.57 10.16,8.89 10.16,19.05 2.54,26.67 2.54,68.58 6.35,72.39 10.16,72.39 SV1.29 | SV2.29 E17.3 E17A.3 88.9,73.66 90.17,72.39 100.33,72.39 101.6,73.66 E16.3 E16A.3
BMA05(1)  (via drill 0.81)  (1 unrouted)
  Top 0.406: SV1.27 10.16,72.39 6.35,72.39 2.54,68.58 2.54,20.32 v3.81,19.05
  Bottom 0.406: H01.V2 4.13,8.57 3.81,8.89 v3.81,19.05 | SV2.27 E17.4 E17A.4 88.9,71.12 90.17,69.85 100.33,69.85 101.6,71.12 E16.4 E16A.4
BMA06(1)  (via drill 0.81)
  Top 0.406: SV2.25 82.55,60.96 82.55,36.83 93.98,25.4 105.41,25.4 v111.76,19.05
  Bottom 0.406: H02.D2 112.08,8.57 111.76,8.89 v111.76,19.05 | SV2.25 E17.5 E17A.5 88.9,68.58 90.17,67.31 100.33,67.31 101.6,68.58 E16.5 E16A.5
BMA07(1)  (via drill 0.81)
  Top 0.406: SV2.23 81.28,59.69 81.28,36.83 93.98,24.13 104.14,24.13 v109.22,19.05
  Bottom 0.406: H02.E2 108.9,8.57 109.22,8.89 v109.22,19.05 | SV2.23 E17.6 E17A.6 88.9,66.04 90.17,64.77 100.33,64.77 101.6,66.04 E16.6 E16A.6
BMA08(1)  (via drill 0.81)
  Top 0.406: SV2.21 80.01,58.42 80.01,36.83 93.98,22.86 99.06,22.86 v102.87,19.05
  Bottom 0.406: H02.H2 102.55,8.57 102.87,8.89 v102.87,19.05 | SV2.21 E17.7 E17A.7 88.9,63.5 90.17,62.23 100.33,62.23 101.6,63.5 E16.7 E16A.7
BMA09(1)  (via drill 0.81)
  Top 0.406: SV2.19 78.74,57.15 78.74,36.83 v96.52,19.05
  Bottom 0.406: H02.K2 96.2,8.57 96.52,8.89 v96.52,19.05 | SV2.19 E17.8 E17A.8 88.9,60.96 90.17,59.69 100.33,59.69 101.6,60.96 E16.8 E16A.8
BMA10(1)  (via drill 0.81)
  Top 0.406: SV2.17 77.47,55.88 77.47,31.75 v90.17,19.05
  Bottom 0.406: H02.M2 89.85,8.57 90.17,8.89 v90.17,19.05 | SV2.17 E17.9 E17A.9 88.9,58.42 90.17,57.15 100.33,57.15 101.6,58.42 E16.9 E16A.9
BMA11(1)  (via drill 0.81)
  Top 0.406: SV2.15 76.2,54.61 76.2,26.67 v83.82,19.05
  Bottom 0.406: H02.P2 83.82,7.62 v83.82,19.05 | SV2.15 E17.10 E17A.10 88.9,55.88 90.17,54.61 100.33,54.61 101.6,55.88 E16.10 E16A.10
BTP2(0)  (via drill 0.81)
  Top 0.406: v288.29,62.23 288.29,54.61 E1.1
  Bottom 0.406: E5.3 275.59,67.31 283.21,67.31 v288.29,62.23 | E1.1 297.18,48.26 300.99,44.45 300.99,31.75 E1.9
BTP2(1)  (via drill 0.81)
  Top 0.406: v278.13,69.85 v278.13,34.29
  Bottom 0.406: H05.V2 258.13,8.57 257.81,8.89 257.81,19.05 R2.1 270.51,31.75 275.59,31.75 v278.13,34.29 | E5.1 v278.13,69.85
CS(0)  (via drill 0.81)  (1 unrouted)
  Top 0.406: SV5.18 264.16,59.69 266.7,59.69 266.7,64.77 v267.97,66.04
  Bottom 0.406: E16.20 E16A.20 114.3,59.69 101.6,59.69 100.33,58.42 E17.20 E17A.20 90.17,58.42 88.9,59.69 73.66,59.69 SV2.18 | E5.11 280.67,64.77 269.24,64.77 v267.97,66.04
CS(1)  (via drill 0.81)
  Top 0.406: v284.48,63.5 284.48,66.04 E5.12
  Bottom 0.406: E5.8 284.48,60.96 v284.48,63.5 | E5.12 E5.13
D0  (2 unrouted)
  Bottom 0.406: SV2.13 E17.11 E17A.11 | SV3.13 140.97,53.34 142.24,54.61 168.91,54.61 E14.18 | E12.2 207.01,58.42 SV4.13
D1  (2 unrouted)
  Bottom 0.406: SV2.11 E17.12 E17A.12 | SV3.11 148.59,50.8 149.86,49.53 168.91,49.53 E14.16 | E12.4 204.47,53.34 SV4.11
D2  (2 unrouted)
  Bottom 0.406: SV2.9 E17.13 E17A.13 | SV3.9 139.7,48.26 143.51,44.45 168.91,44.45 E14.14 | E12.6 SV4.9
D3  (2 unrouted)
  Bottom 0.406: E17.15 E17A.15 90.17,45.72 88.9,46.99 73.66,46.99 SV2.8 | E14.12 168.91,39.37 144.78,39.37 139.7,44.45 137.16,44.45 SV3.8 | E12.8 204.47,43.18 203.2,44.45 200.66,44.45 SV4.8
D4  (via drill 0.81)  (2 unrouted)
  Top 0.406: SV4.10 196.85,45.72 v196.85,35.56
  Bottom 0.406: E17.16 E17A.16 90.17,48.26 88.9,49.53 73.66,49.53 SV2.10 | E14.9 146.05,40.64 139.7,46.99 137.16,46.99 SV3.10 | E12.11 226.06,35.56 v196.85,35.56
D5  (via drill 0.81)  (2 unrouted)
  Top 0.406: SV4.12 195.58,46.99 v195.58,41.91
  Bottom 0.406: E17.17 E17A.17 90.17,50.8 88.9,52.07 73.66,52.07 SV2.12 | SV3.12 137.16,49.53 139.7,49.53 143.51,45.72 E14.7 | E12.13 227.33,41.91 v195.58,41.91
D6  (via drill 0.81)  (2 unrouted)
  Top 0.406: SV4.14 194.31,48.26 v194.31,46.99
  Bottom 0.406: E17.18 E17A.18 90.17,53.34 88.9,54.61 73.66,54.61 SV2.14 | SV3.14 137.16,52.07 148.59,52.07 149.86,50.8 E14.5 | E12.15 227.33,46.99 v194.31,46.99
D7  (via drill 0.81)  (2 unrouted)
  Top 0.406: SV4.16 v193.04,49.53
  Bottom 0.406: E17.19 E17A.19 90.17,55.88 88.9,57.15 73.66,57.15 SV2.16 | SV3.16 137.16,57.15 161.29,57.15 E14.3 | E12.17 227.33,52.07 205.74,52.07 203.2,49.53 v193.04,49.53
D8  (via drill 0.81)  (2 unrouted)
  Top 0.406: SV3.6 132.08,43.18 130.81,44.45 v130.81,90.17 | SV4.6 200.66,44.45 203.2,44.45 204.47,45.72 204.47,74.93 E13.2
  Bottom 0.406: E16.11 E16A.11 111.76,49.53 111.76,44.45 109.22,41.91 73.66,41.91 SV2.6 | E15.18 168.91,90.17 v130.81,90.17
D9  (via drill 0.81)  (2 unrouted)
  Top 0.406: SV3.5 137.16,44.45 133.35,44.45 132.08,45.72 v132.08,85.09 | SV4.5 203.2,43.18 205.74,45.72 205.74,71.12 E13.4
  Bottom 0.406: E16.12 E16A.12 110.49,48.26 110.49,44.45 109.22,43.18 SV2.5 | E15.16 168.91,85.09 v132.08,85.09
D10  (via drill 0.81)  (2 unrouted)
  Top 0.406: SV3.7 137.16,46.99 134.62,46.99 133.35,48.26 v133.35,80.01 | SV4.7 203.2,46.99 203.2,76.2 v208.28,81.28
  Bottom 0.406: E16.13 E16A.13 109.22,46.99 109.22,44.45 76.2,44.45 SV2.7 | E15.14 168.91,80.01 v133.35,80.01 | v208.28,81.28 E13.6
D11  (via drill 0.81)  (2 unrouted)
  Top 0.406: SV3.4 130.81,40.64 128.27,43.18 v128.27,74.93 | SV4.4 200.66,41.91 203.2,41.91 207.01,45.72 207.01,62.23 E13.8
  Bottom 0.406: E16.15 E16A.15 109.22,39.37 73.66,39.37 SV2.4 | E15.12 168.91,74.93 v128.27,74.93
DDELAY
  Bottom 0.406: E1.5 298.45,34.29 298.45,31.75 300.99,29.21 303.53,29.21 309.88,35.56 309.88,48.26 E2.9
EA0(1)  (via drill 0.81)  (2 unrouted)
  Top 0.406: E19.3 27.94,53.34 27.94,63.5 12.7,78.74 SV1.33 | v156.21,78.74 156.21,38.1 v175.26,19.05
  Bottom 0.406: SV2.33 E17.1 E17A.1 88.9,78.74 90.17,77.47 100.33,77.47 101.6,78.74 E16.1 E16A.1 | H03.D2 175.58,8.57 175.26,8.89 v175.26,19.05 | SV3.33 v156.21,78.74
EA1(1)  (via drill 0.81)  (2 unrouted)
  Top 0.406: E19.2 26.67,54.61 26.67,63.5 12.7,77.47 10.16,77.47 10.16,74.93 SV1.30 | v154.94,72.39 154.94,36.83 v172.72,19.05
  Bottom 0.406: E16.26 E16A.26 114.3,74.93 101.6,74.93 100.33,73.66 E17.26 E17A.26 90.17,73.66 88.9,74.93 73.66,74.93 SV2.30 | H03.E2 172.4,8.57 172.72,8.89 v172.72,19.05 | v154.94,72.39 137.16,72.39 SV3.30
EA2(1)  (via drill 0.81)  (2 unrouted)
  Top 0.406: E19.1 25.4,63.5 12.7,76.2 SV1.31 | v153.67,77.47 153.67,31.75 v166.37,19.05
  Bottom 0.406: SV2.31 E17.2 E17A.2 88.9,76.2 90.17,74.93 100.33,74.93 101.6,76.2 E16.2 E16A.2 | H03.H2 166.05,8.57 166.37,8.89 v166.37,19.05 | SV3.31 139.7,77.47 v153.67,77.47
FS(1)  (1 unrouted)
  Top 0.406: SV1.34 7.62,80.01 7.62,100.33 19.05,100.33 59.69,59.69 59.69,41.91 E18.8 | E5.4 275.59,67.31 275.59,69.85 E5.2
  Bottom 0.406: SV5.34 264.16,77.47 267.97,77.47 E5.2
GND  (via drill 0.81)  (4 unrouted)
  Top 0.711: C13.2 106.68,45.72 | 106.68,45.72 v106.68,38.1 106.68,27.94 v115.57,19.05 | v85.09,38.1 85.09,45.72 E17.14 E17A.14 93.98,52.07 C14.2 | E5.7 276.86,58.42 | 276.86,58.42 C5.2 276.86,35.56 E4.7 276.86,30.48 E1.8 297.18,33.02 C2.2 297.18,55.88 | C6.2 276.86,58.42 | E16.14 106.68,45.72 | E15.10 165.1,71.12 | 165.1,71.12 C11.2 v165.1,38.1 E14.10 | C12.2 165.1,71.12 | 223.52,38.1 E12.10 | 223.52,38.1 C9.2 223.52,71.12 | E13.10 223.52,71.12 | C10.2 223.52,71.12 | v242.57,19.05 223.52,38.1 | R2.2 265.43,24.13 SV5.1 | E16A.14 106.68,45.72 | 297.18,55.88 C3.2 297.18,81.28 | 297.18,81.28 C4.2 | E2.8 297.18,55.88 | E3.8 297.18,81.28
  Top 0.813: C15.2 E18.7
  Bottom 0.711: H02.C2 115.25,8.57 115.57,8.89 v115.57,19.05 | SV2.2 SV2.1 73.66,38.1 73.66,35.56 82.55,35.56 v85.09,38.1 v106.68,38.1 | H03.C2 178.75,8.57 179.07,8.89 179.07,13.97 177.8,15.24 v177.8,19.05 177.8,25.4 v165.1,38.1 | H04.C2 242.25,8.57 242.57,8.89 v242.57,19.05 | H05.C2 305.75,8.57 306.07,8.89 306.07,19.05 297.81,27.31 | SV3.2 SV3.1 137.16,38.1 137.16,35.56 160.02,35.56 E14.10 | SV5.2 264.16,38.1 | SV5.1 264.16,38.1 | 264.16,38.1 264.16,35.56 266.7,33.02 E4.7 | SV4.2 SV4.1 200.66,38.1 200.66,36.83 219.71,36.83 E12.10 | 20.32,90.17 20.28,90.21 X1.2 | E1.8 297.81,27.31 | R1.2 297.81,27.31
  Bottom 0.813: H01.C2 51.75,8.57 52.07,8.89 52.07,13.97 50.8,15.24 50.8,33.02 | SV1.2 10.16,38.1 | SV1.1 10.16,38.1 | 10.16,38.1 10.16,35.56 17.78,35.56 20.32,38.1 | 20.32,38.1 C16.2 E19.8 30.48,33.02 50.8,33.02 | 20.32,38.1 20.32,43.18 22.86,45.72 E19.5 E19.4 20.32,53.34 20.32,90.17 | 50.8,33.02 C15.2
  pour Bottom (isolate 0.711): 0,15.24 316.23,15.24 316.23,116.84 0,116.84
  pour Top (isolate 0.711): 0,15.24 316.23,15.24 316.23,116.84 0,116.84
MBODD_P  (via drill 0.81)  (1 unrouted)
  Top 0.406: v256.54,83.82 256.54,26.67 v264.16,19.05 | E15.11 171.45,72.39 171.45,76.2 | 171.45,76.2 171.45,81.28 | 171.45,81.28 171.45,85.09 E15.17 | E15.15 171.45,81.28 | E15.13 171.45,76.2
  Bottom 0.406: H05.T2 264.48,8.57 264.16,8.89 v264.16,19.05 | SV5.42 261.62,88.9 v256.54,83.82 | SV3.42 137.16,87.63 168.91,87.63 E15.17
MCBMB00(0)  (via drill 0.81)  (1 unrouted)
  Top 0.406: SV2.38 67.31,78.74 67.31,25.4 73.66,19.05 v77.47,19.05 | SV3.38 137.16,82.55 139.7,82.55 144.78,77.47 v144.78,58.42
  Bottom 0.406: H02.S2 77.47,7.62 v77.47,19.05 | v144.78,58.42 E14.2
MCBMB01(0)  (via drill 0.81)  (1 unrouted)
  Top 0.406: SV3.35 139.7,81.28 143.51,77.47 v143.51,53.34
  Bottom 0.406: H02.T2 73.98,8.57 73.66,8.89 73.66,19.05 67.31,25.4 67.31,76.2 71.12,80.01 73.66,80.01 SV2.35 | v143.51,53.34 E14.4
MCBMB02(0)  (via drill 0.81)  (1 unrouted)
  Top 0.406: SV3.36 137.16,80.01 139.7,80.01 142.24,77.47 v142.24,49.53
  Bottom 0.406: H02.V2 67.63,8.57 67.31,8.89 67.31,19.05 66.04,20.32 66.04,76.2 71.12,81.28 SV2.36 | E14.6 143.51,48.26 v142.24,49.53
MCBMB03(0)  (via drill 0.81)  (1 unrouted)
  Top 0.406: E14.8 161.29,44.45 161.29,90.17 156.21,95.25 137.16,95.25 SV3.46 | v48.26,19.05 48.26,66.04 19.05,95.25 10.16,95.25 SV1.46
  Bottom 0.406: H01.D2 48.58,8.57 48.26,8.89 v48.26,19.05
MCBMB04(0)  (via drill 0.81)  (1 unrouted)
  Top 0.406: v168.91,36.83 161.29,36.83 160.02,38.1 160.02,90.17 156.21,93.98 148.59,93.98 147.32,92.71 137.16,92.71 SV3.44 | v45.72,19.05 46.99,20.32 46.99,63.5 17.78,92.71 10.16,92.71 SV1.44
  Bottom 0.406: H01.E2 45.72,7.62 v45.72,19.05 | E14.11 v168.91,36.83
MCBMB05(0)  (via drill 0.81)  (1 unrouted)
  Top 0.406: v158.75,41.91 158.75,90.17 156.21,92.71 148.59,92.71 147.32,91.44 SV3.43 | SV1.43 16.51,91.44 45.72,62.23 45.72,25.4 v39.37,19.05
  Bottom 0.406: E14.13 168.91,41.91 v158.75,41.91 | H01.H2 39.37,8.26 v39.37,19.05
MCBMB06(0)  (via drill 0.81)
  Top 0.406: v152.4,46.99 152.4,26.67 v160.02,19.05
  Bottom 0.406: H03.K2 159.7,8.57 160.02,8.89 v160.02,19.05 | v152.4,46.99 168.91,46.99 E14.15
MCBMB07(0)  (via drill 0.81)
  Top 0.406: v151.13,52.07 151.13,21.59 v153.67,19.05
  Bottom 0.406: H03.M2 153.35,8.57 153.67,8.89 v153.67,19.05 | v151.13,52.07 168.91,52.07 E14.17
MCBMB08(0)  (via drill 0.81)
  Top 0.406: v149.86,91.44 149.86,21.59 v147.32,19.05
  Bottom 0.406: H03.P2 147,8.57 147.32,8.89 v147.32,19.05 | v149.86,91.44 E15.2
MCBMB09(0)  (via drill 0.81)
  Top 0.406: v148.59,86.36 148.59,26.67 v140.97,19.05
  Bottom 0.406: H03.S2 140.65,8.57 140.97,8.89 v140.97,19.05 | v148.59,86.36 E15.4
MCBMB10(0)  (via drill 0.81)
  Top 0.406: v147.32,81.28 147.32,29.21 v137.16,19.05
  Bottom 0.406: v147.32,81.28 E15.6 | H03.T2 137.16,8.26 v137.16,19.05
MCBMB11(0)  (via drill 0.81)
  Top 0.406: v146.05,76.2 146.05,34.29 v130.81,19.05
  Bottom 0.406: H03.V2 131.13,8.57 130.81,8.89 v130.81,19.05 | v146.05,76.2 E15.8
MEM00  (via drill 0.81)
  Top 0.406: v218.44,54.61 218.44,36.83 v236.22,19.05
  Bottom 0.406: H04.E2 236.22,7.62 v236.22,19.05 | v218.44,54.61 227.33,54.61 E12.18
MEM01  (via drill 0.81)
  Top 0.406: v217.17,49.53 217.17,31.75 v229.87,19.05
  Bottom 0.406: H04.H2 229.87,7.62 v229.87,19.05 | v217.17,49.53 227.33,49.53 E12.16
MEM02  (via drill 0.81)
  Top 0.406: v215.9,44.45 215.9,26.67 v223.52,19.05
  Bottom 0.406: H04.K2 223.2,8.57 223.52,8.89 v223.52,19.05 | v215.9,44.45 227.33,44.45 E12.14
MEM03  (via drill 0.81)
  Top 0.406: v214.63,39.37 214.63,21.59 v217.17,19.05
  Bottom 0.406: H04.M2 216.85,8.57 217.17,8.89 v217.17,19.05 | v214.63,39.37 227.33,39.37 E12.12
MEM04  (via drill 0.81)
  Top 0.406: v213.36,40.64 213.36,21.59 v210.82,19.05
  Bottom 0.406: H04.P2 210.5,8.57 210.82,8.89 v210.82,19.05 | v213.36,40.64 E12.9
MEM05  (via drill 0.81)
  Top 0.406: v212.09,45.72 212.09,26.67 v204.47,19.05
  Bottom 0.406: H04.S2 204.15,8.57 204.47,8.89 v204.47,19.05 | v212.09,45.72 E12.7
MEM06  (via drill 0.81)
  Top 0.406: v210.82,50.8 210.82,29.21 v200.66,19.05
  Bottom 0.406: H04.T2 200.98,8.57 200.66,8.89 v200.66,19.05 | v210.82,50.8 E12.5
MEM07  (via drill 0.81)
  Top 0.406: v209.55,55.88 209.55,34.29 v194.31,19.05
  Bottom 0.406: v209.55,55.88 E12.3 | H04.V2 194.31,8.26 v194.31,19.05
MEM08  (via drill 0.81)  (1 unrouted)
  Top 0.406: SV5.41 273.05,81.28 273.05,30.48 274.32,29.21 289.56,29.21 v302.26,16.51
  Bottom 0.406: H05.D2 302.58,8.57 302.26,8.89 v302.26,16.51 | E13.18 227.33,87.63 203.2,87.63 SV4.41
MEM09  (via drill 0.81)  (1 unrouted)
  Top 0.406: SV5.39 266.7,86.36 271.78,81.28 271.78,30.48 274.32,27.94 288.29,27.94 v299.72,16.51
  Bottom 0.406: H05.E2 299.4,8.57 299.72,8.89 v299.72,16.51 | E13.16 227.33,82.55 207.01,82.55 203.2,86.36 SV4.39
MEM10  (via drill 0.81)  (1 unrouted)
  Top 0.406: SV5.40 264.16,85.09 266.7,85.09 270.51,81.28 270.51,30.48 274.32,26.67 287.02,26.67 293.37,20.32 v293.37,19.05
  Bottom 0.406: H05.H2 293.05,8.57 293.37,8.89 v293.37,19.05 | E13.14 227.33,77.47 209.55,77.47 204.47,82.55 204.47,83.82 203.2,85.09 200.66,85.09 SV4.40
MEM11  (via drill 0.81)  (1 unrouted)
  Top 0.406: SV5.37 269.24,80.01 269.24,30.48 274.32,25.4 280.67,25.4 v287.02,19.05
  Bottom 0.406: H05.K2 286.7,8.57 287.02,8.89 v287.02,19.05 | E13.12 227.33,74.93 210.82,74.93 SV4.37
MEM_P  (via drill 0.81)
  Top 0.406: E13.9 219.71,72.39 219.71,36.83 220.98,35.56 222.25,35.56 v238.76,19.05
  Bottom 0.406: H04.D2 239.08,9.84 238.76,10.16 v238.76,19.05
MEMDONE(0)
  Bottom 0.406: H05.S2 267.65,8.57 267.97,8.89 267.97,15.24 279.4,26.67 279.4,35.56 279.4,43.18 E4.13
MEMDONE(1)
  Bottom 0.406: E4.11 E4.12 284.48,43.18 297.18,55.88 297.18,60.96 E2.5
MEMSTART(0)  (via drill 0.81)
  Top 0.406: v279.4,72.39 v279.4,60.96
  Bottom 0.406: E3.1 297.18,99.06 300.99,95.25 300.99,81.28 | 300.99,81.28 E3.9 | 300.99,81.28 300.99,77.47 295.91,72.39 v279.4,72.39 | v279.4,60.96 E5.6
MEMSTART(1)  (via drill 0.81)
  Top 0.406: R1.1 276.86,24.13 274.32,24.13 267.97,30.48 v267.97,63.5
  Bottom 0.406: H05.M2 280.35,8.57 280.67,8.89 R1.1 | v267.97,63.5 E5.5
N$2
  Bottom 0.406: E16.17 E16A.17
N$3
  Bottom 0.406: E16.18 E16A.18
N$4
  Bottom 0.406: E16A.19 E16.19
N$5
  Bottom 0.711: E3.15 C17.1 R4.2
N$6
  Bottom 0.711: E3.14 C17.2
N$7
  Bottom 0.711: R5.2 C18.1 E3.7
N$8
  Bottom 0.711: C18.2 E3.6
N$9
  Bottom 0.711: E1.15 C19.1 R6.2
N$10
  Bottom 0.711: C19.2 E1.14
N$11
  Bottom 0.711: E1.7 C20.1 R7.2
N$12
  Bottom 0.711: C20.2 E1.6
N$13
  Bottom 0.711: E2.15 C21.1 R8.2
N$14
  Bottom 0.711: E2.14 C21.2
N$15
  Bottom 0.711: E2.7 C22.1 R9.2
N$16
  Bottom 0.711: C22.2 E2.6
N$18
  Bottom 0.406: E19.15 35.56,55.88 FIELDS.1
N$19
  Bottom 0.406: E19.14 35.56,53.34 FIELDS.3
N$20
  Bottom 0.406: E19.13 35.56,50.8 FIELDS.5
N$21
  Bottom 0.406: E19.12 35.56,48.26 FIELDS.7
N$22
  Bottom 0.406: E19.11 35.56,45.72 FIELDS.9
N$23
  Bottom 0.406: E19.10 35.56,43.18 FIELDS.11
N$24
  Bottom 0.406: E19.9 35.56,40.64 FIELDS.13
N$25
  Bottom 0.406: FIELDS.15 35.56,38.1 33.02,35.56 27.94,40.64 E19.7
N$26
  Bottom 0.406: FIELDS.8 E18.4
N$27
  Bottom 0.406: FIELDS.6 E18.3
N$28
  Bottom 0.406: E18.2 FIELDS.4
N$29
  Bottom 0.406: FIELDS.2 E18.1
N$30
  Bottom 0.406: FIELDS.10 E18.5
N$31
  Bottom 0.406: FIELDS.12 E18.6
N$32
  Bottom 0.406: FIELDS.14 44.45,41.91 52.07,41.91 54.61,44.45 54.61,46.99 E18.12
N$33
  Bottom 0.406: E18.11 55.88,45.72 55.88,43.18 50.8,38.1 FIELDS.16
OE(0)  (via drill 0.81)  (2 unrouted)
  Top 0.406: SV5.22 260.35,66.04 v260.35,90.17
  Bottom 0.406: E16.22 E16A.22 114.3,64.77 101.6,64.77 100.33,63.5 E17.22 E17A.22 90.17,63.5 88.9,64.77 73.66,64.77 SV2.22 | E13.1 226.06,93.98 E13.19 229.87,90.17 229.87,59.69 E12.19 226.06,60.96 E12.1 219.71,62.23 200.66,62.23 SV4.22 | v260.35,90.17 266.7,90.17 267.97,91.44 E3.4 | SV5.22 264.16,62.23 280.67,62.23 E5.10
PARITY  (via drill 0.81)  (2 unrouted)
  Top 0.406: SV3.3 137.16,41.91 130.81,41.91 129.54,43.18 v129.54,69.85 | SV4.3 203.2,40.64 208.28,45.72 208.28,60.96 v215.9,68.58 | E13.11 229.87,72.39 229.87,76.2 | 229.87,76.2 229.87,81.28 | 229.87,81.28 229.87,85.09 E13.17 | E13.15 229.87,81.28 | E13.13 229.87,76.2
  Bottom 0.406: E16.16 E16A.16 113.03,45.72 113.03,44.45 109.22,40.64 SV2.3 | E15.9 158.75,69.85 v129.54,69.85 | v215.9,68.58 226.06,68.58 E13.11
SDELAY
  Bottom 0.406: E3.5 295.91,87.63 295.91,74.93 E2.1
STROBE(0)
  Bottom 0.406: H05.P2 274.32,8.26 274.32,19.05 280.67,25.4 280.67,36.83 E4.10
STROBE(1)
  Bottom 0.406: E4.8 E4.9 284.48,38.1 284.48,41.91 299.72,57.15 299.72,63.5 E2.13
VCC  (via drill 0.81)  (4 unrouted)
  Top 0.711: E4.14 C5.1 280.67,54.61 280.67,72.39 E5.14 C6.1 281.94,83.82 266.7,99.06 SV5.49 | E14.20 C11.1 167.64,68.58 167.64,91.44 E15.20 C12.1 167.64,101.6 140.97,101.6 SV3.49 | E12.20 C9.1 226.06,68.58 226.06,91.44 E13.20 C10.1 226.06,101.6 204.47,101.6 SV4.49 | SV1.49 17.78,99.06 58.42,58.42 E18.14 | C14.1 83.82,99.06 SV2.49 | 299.72,58.42 299.72,54.61 C2.1 E1.16 299.72,45.72 v299.72,43.18 299.72,38.1 E1.11 E1.10 | 299.72,58.42 299.72,60.96 | 299.72,60.96 E2.11 | 299.72,60.96 v299.72,68.58 299.72,71.12 E2.16 C3.1 299.72,80.01 299.72,83.82 | 299.72,83.82 299.72,86.36 | 299.72,86.36 E3.11 | 299.72,86.36 v299.72,93.98 299.72,96.52 E3.16 C4.1 | E1.3 E1.2 | E2.3 E2.2 | E2.10 299.72,58.42 | E3.10 299.72,83.82 | E3.3 E3.2
  Top 0.813: E18.14 55.88,53.34 C15.1
  Bottom 0.711: 99.06,81.28 97.79,81.28 97.79,78.74 E17.28 E17A.28 | 99.06,81.28 111.76,81.28 | 111.76,81.28 116.84,81.28 116.84,78.74 | E16A.28 116.84,78.74 | 116.84,78.74 E16.28 | E19.6 C16.1 | C13.1 111.76,81.28 | C14.1 99.06,81.28 | SV3.50 SV3.49 | SV2.50 SV2.49 | SV4.50 SV4.49 | SV5.50 SV5.49 284.48,99.06 R5.1 E3.3 v299.72,93.98 | SV1.49 15.24,102.87 15.24,109.22 X1.1 | R9.1 E2.3 v299.72,68.58 | R7.1 E1.3 v299.72,43.18 | E3.11 R4.1 | E2.11 R8.1 | R6.1 E1.11 | E4.14 276.86,48.26 E4.2 E4.3 276.86,40.64 E4.5 E4.6
  Bottom 0.813: E19.6 29.21,46.99 29.21,52.07 E19.16 35.56,58.42 55.88,58.42 E18.14 | SV1.50 SV1.49
WE(0)  (via drill 0.81)  (2 unrouted)
  Top 0.406: SV3.32 137.16,74.93 139.7,74.93 140.97,73.66 v140.97,60.96 | E1.4 285.75,49.53 285.75,57.15 E5.9
  Bottom 0.406: E16.27 E16A.27 114.3,77.47 101.6,77.47 100.33,76.2 E17.27 E17A.27 90.17,76.2 88.9,77.47 73.66,77.47 SV2.32 | E15.1 167.64,93.98 E15.19 171.45,90.17 171.45,59.69 E14.19 167.64,58.42 165.1,60.96 E14.1 v140.97,60.96 | SV5.32 260.35,73.66 260.35,60.96 261.62,59.69 280.67,59.69 E5.9

### Text on the board
Top: 8i H01 | 8i H02 | 8i H03 | 8i H04 | 8i H05 | 12 N20 | 12 N21 | 12 N22 | 12 N23 | 12 N24
Bottom: 8i H01 | 8i H02 | 8i H03 | 8i H04 | 8i H05 | 12 N20 | 12 N21 | 12 N22 | 12 N23 | 12 N24
tPlace: 7 6 5 4 3 2 1 0 | R1, R2 are needed if cabling was used.
tValues: 8i H01 | 8i H02 | 8i H03 | 8i H04 | 8i H05 | 12 N20 | 12 N21 | 12 N22 | 12 N23 | 12 N24 | VCC | GND